# Altium schematic sheet schematic_1.SchDoc
size A4; SheetNumber: 1; SheetTotal: 1
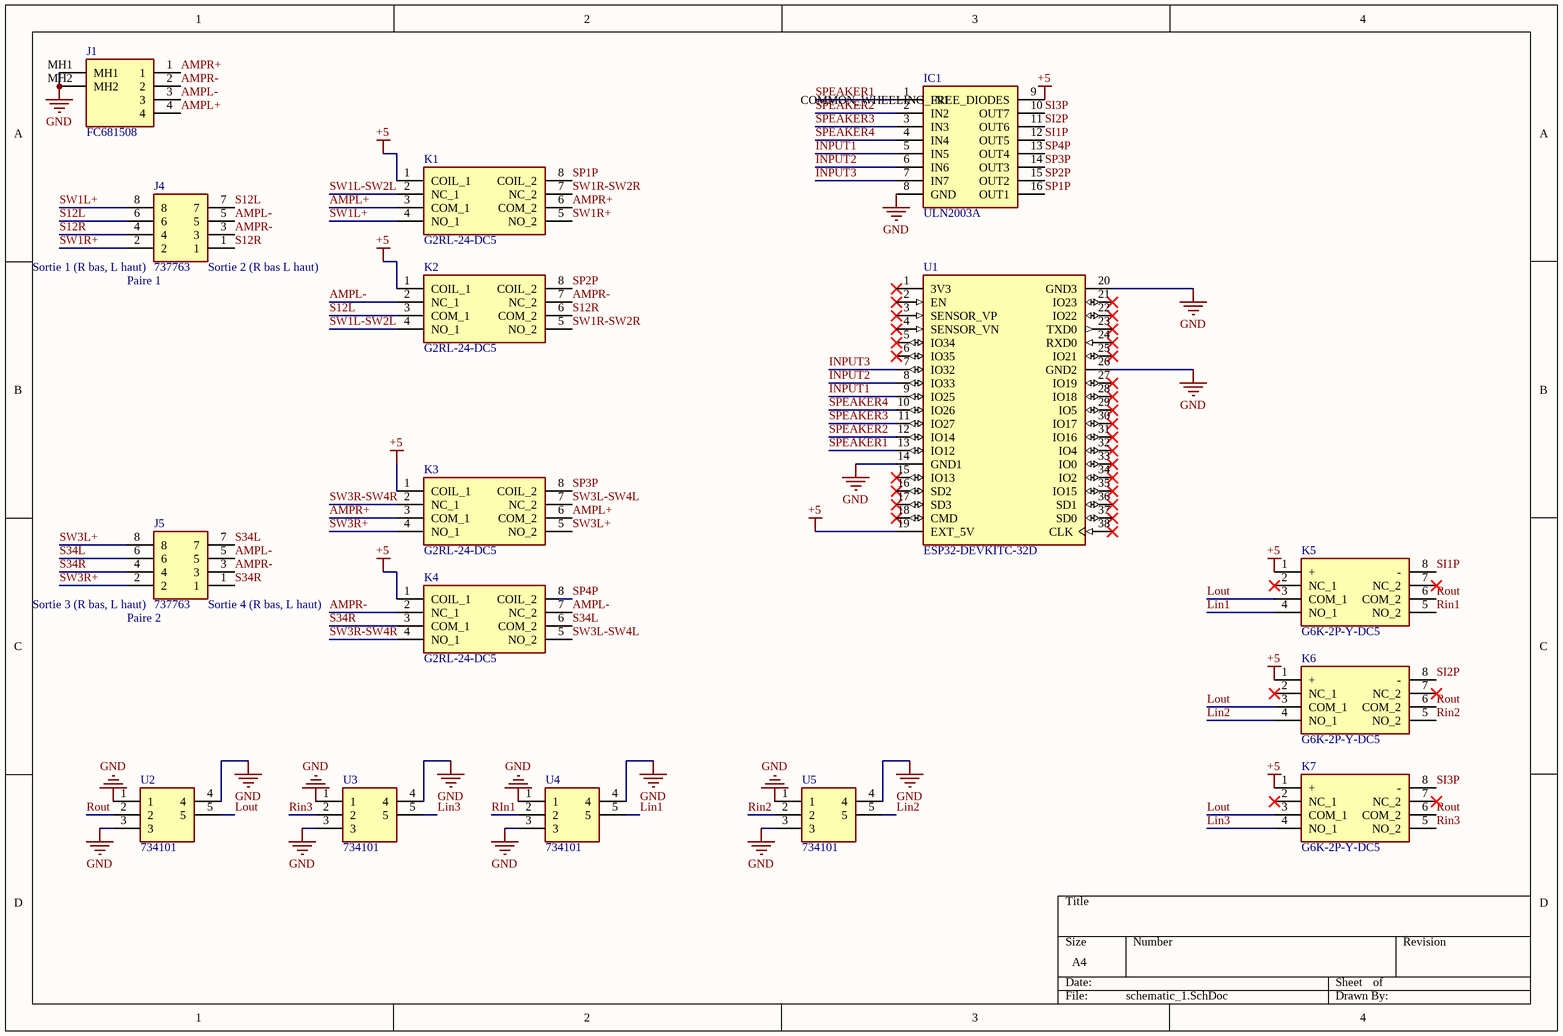
[diagram p0: schematic_1.SchDoc]

## Parts
IC1  ULN2003A  [DIP794W56P254L1918H533Q16N]
J1  FC681508  [FC681508]
J4  737763  [737763]
J5  737763  [737763]
K1  G2RL-24-DC5  [G2RL24DC5]
K2  G2RL-24-DC5  [G2RL24DC5]
K3  G2RL-24-DC5  [G2RL24DC5]
K4  G2RL-24-DC5  [G2RL24DC5]
K5  G6K-2P-Y-DC5  [G6K2PYDC12]
K6  G6K-2P-Y-DC5  [G6K2PYDC12]
K7  G6K-2P-Y-DC5  [G6K2PYDC12]
U1  ESP32-DEVKITC-32D  [MODULE_ESP32-DEVKITC-32D]
U2  734101  [734101]
U3  734101  [734101]
U4  734101  [734101]
U5  734101  [734101]

## Nets
+5: IC1.9(COMMON_WHEELING_FREE_DIODES) K1.1(COIL_1) K2.1(COIL_1) K3.1(COIL_1) K4.1(COIL_1) K5.1(+) K6.1(+) K7.1(+) U1.19(EXT_5V)
GND: IC1.8(GND) J1.MH1 J1.MH2 U1.14(GND1) U1.20(GND3) U1.26(GND2) U2.1 U2.3 U2.4 U3.1 U3.3 U3.4 U4.1 U4.3 U4.4 U5.1 U5.3 U5.4
AMPL+: J1.4 K1.3(COM_1) K3.6(COM_2)
AMPL-: J1.3 J4.5 J5.5 K2.2(NC_1) K4.7(NC_2)
AMPR+: J1.1 K1.6(COM_2) K3.3(COM_1)
AMPR-: J1.2 J4.3 J5.3 K2.7(NC_2) K4.2(NC_1)
INPUT1: IC1.5(IN5) U1.9(IO25)
INPUT2: IC1.6(IN6) U1.8(IO33)
INPUT3: IC1.7(IN7) U1.7(IO32)
Lin1: K5.4(NO_1) U4.5
Lin2: K6.4(NO_1) U5.5
Lin3: K7.4(NO_1) U3.5
Lout: K5.3(COM_1) K6.3(COM_1) K7.3(COM_1) U2.5
RIn1: K5.5(NO_2) U4.2
Rin2: K6.5(NO_2) U5.2
Rin3: K7.5(NO_2) U3.2
Rout: K5.6(COM_2) K6.6(COM_2) K7.6(COM_2) U2.2
S12L: J4.6 J4.7 K2.3(COM_1)
S12R: J4.1 J4.4 K2.6(COM_2)
S34L: J5.6 J5.7 K4.6(COM_2)
S34R: J5.1 J5.4 K4.3(COM_1)
SI1P: IC1.12(OUT5) K5.8(-)
SI2P: IC1.11(OUT6) K6.8(-)
SI3P: IC1.10(OUT7) K7.8(-)
SP1P: IC1.16(OUT1) K1.8(COIL_2)
SP2P: IC1.15(OUT2) K2.8(COIL_2)
SP3P: IC1.14(OUT3) K3.8(COIL_2)
SP4P: IC1.13(OUT4) K4.8(COIL_2)
SPEAKER1: IC1.1(IN1) U1.13(IO12)
SPEAKER2: IC1.2(IN2) U1.12(IO14)
SPEAKER3: IC1.3(IN3) U1.11(IO27)
SPEAKER4: IC1.4(IN4) U1.10(IO26)
SW1L+: J4.8 K1.4(NO_1)
SW1L-SW2L: K1.2(NC_1) K2.4(NO_1)
SW1R+: J4.2 K1.5(NO_2)
SW1R-SW2R: K1.7(NC_2) K2.5(NO_2)
SW3L+: J5.8 K3.5(NO_2)
SW3L-SW4L: K3.7(NC_2) K4.5(NO_2)
SW3R+: J5.2 K3.4(NO_1)
SW3R-SW4R: K3.2(NC_1) K4.4(NO_1)

Not connected (* = marked no-connect by the designer): K5 2(NC_1)* 7(NC_2)*; K6 2(NC_1)* 7(NC_2)*; K7 2(NC_1)* 7(NC_2)*; U1 1(3V3)* 2(EN)* 3(SENSOR_VP)* 4(SENSOR_VN)* 5(IO34)* 6(IO35)* 15(IO13)* 16(SD2)* 17(SD3)* 18(CMD)* 21(IO23)* 22(IO22)* 23(TXD0)* 24(RXD0)* 25(IO21)* 27(IO19)* 28(IO18)* 29(IO5)* 30(IO17)* 31(IO16)* 32(IO4)* 33(IO0)* 34(IO2)* 35(IO15)* 36(SD1)* 37(SD0)* 38(CLK)*

## Notes on the sheet
- (near J4) Sortie 1 (R bas, L haut)
- (near J4) Paire 1
- (near J4) Sortie 2 (R bas L haut)
- (near J5) Sortie 3 (R bas, L haut)
- (near J5) Paire 2
- (near J5) Sortie 4 (R bas, L haut)

## Library data of the parts
IC1 = ULN2003A: Integrated Circuit; Manufacturer_Name: STMicroelectronics; Datasheet Link: http://www.st.com/web/en/resource/technical/document/datasheet/CD00001244.pdf; Height: 5.33mm; Manufacturer_Part_Number: ULN2003A; Mouser Part Number: 511-ULN2003A; Mouser Price/Stock: https://www.mouser.co.uk/ProductDetail/STMicroelectronics/ULN2003A?qs=FOlmdCx%252BAA1P2avu3tWCRw%3D%3D; Arrow Part Number: ULN2003A; Arrow Price/Stock: https://www.arrow.com/en/products/uln2003a/stmicroelectronics?region=nac
J1 = FC681508: Connector; Manufacturer_Name: CLIFF ELECTRONIC COMPONENTS; Datasheet Link: https://componentsearchengine.com/Datasheets/2/FC681508.pdf; Height: 25mm; Manufacturer_Part_Number: FC681508
J4 J5 = 737763: Connector; Manufacturer_Name: Tru Components; Datasheet Link: https://asset.conrad.com/media10/add/160267/c1/-/en/001570036DS01/fiche-technique-1570036-fiche-haut-parleur-embase-femelle-horizontale-https://asset.conrad.com/media10/add/160267/c1/-/en/001570036DS01/datasheet-1570036-tru-components-737763-audio-jack-so; Height: 29.6mm; Manufacturer_Part_Number: 737763
K1-K4 = G2RL-24-DC5: Relay or Contactor; Manufacturer_Name: Omron Electronics; Datasheet Link: https://www.mouser.in/datasheet/2/307/en-g2rl-472571.pdf; Height: 15.7mm; Manufacturer_Part_Number: G2RL-24-DC5; Mouser Part Number: 653-G2RL-24-DC5; Mouser Price/Stock: https://www.mouser.co.uk/ProductDetail/Omron-Electronics/G2RL-24-DC5?qs=HDDQUw%2F3PhqJg7sIn7s%2Fiw%3D%3D; Arrow Part Number: G2RL-24-DC5; Arrow Price/Stock: https://www.arrow.com/en/products/g2rl-24-dc5/omron?region=nac
K5-K7 = G6K-2P-Y-DC5: Relay or Contactor; Manufacturer_Name: Omron Electronics; Datasheet Link: https://omronfs.omron.com/en_US/ecb/products/pdf/en-g6k.pdf; Height: 5.3mm; Manufacturer_Part_Number: G6K-2P-Y-DC5; Mouser Part Number: 653-G6K-2P-Y-DC5; Mouser Price/Stock: https://www.mouser.co.uk/ProductDetail/Omron-Electronics/G6K-2P-Y-DC5?qs=HDDQUw%2F3PhrvM4dCY49XOA%3D%3D
U1 = ESP32-DEVKITC-32D: Eval Board For Esp-Wroom-32; Package: None; Availability: Unavailable; Value: *; MP: ESP32-DEVKITC-32D; Price: None
U2-U5 = 734101: Undefined or Miscellaneous; Manufacturer_Name: Tru Components; Datasheet Link: https://asset.conrad.com/media10/add/160267/c1/-/en/001566157DS00/fiche-technique-1566157-jack-35-mm-embase-femelle-horizontale-tru-components-734101-nombre-de-poles-num-3-stereo-noir-1-pcs.pdf; Height: 6mm; Manufacturer_Part_Number: 734101